# EAGLE design loader (EAGLE 9.4.1)
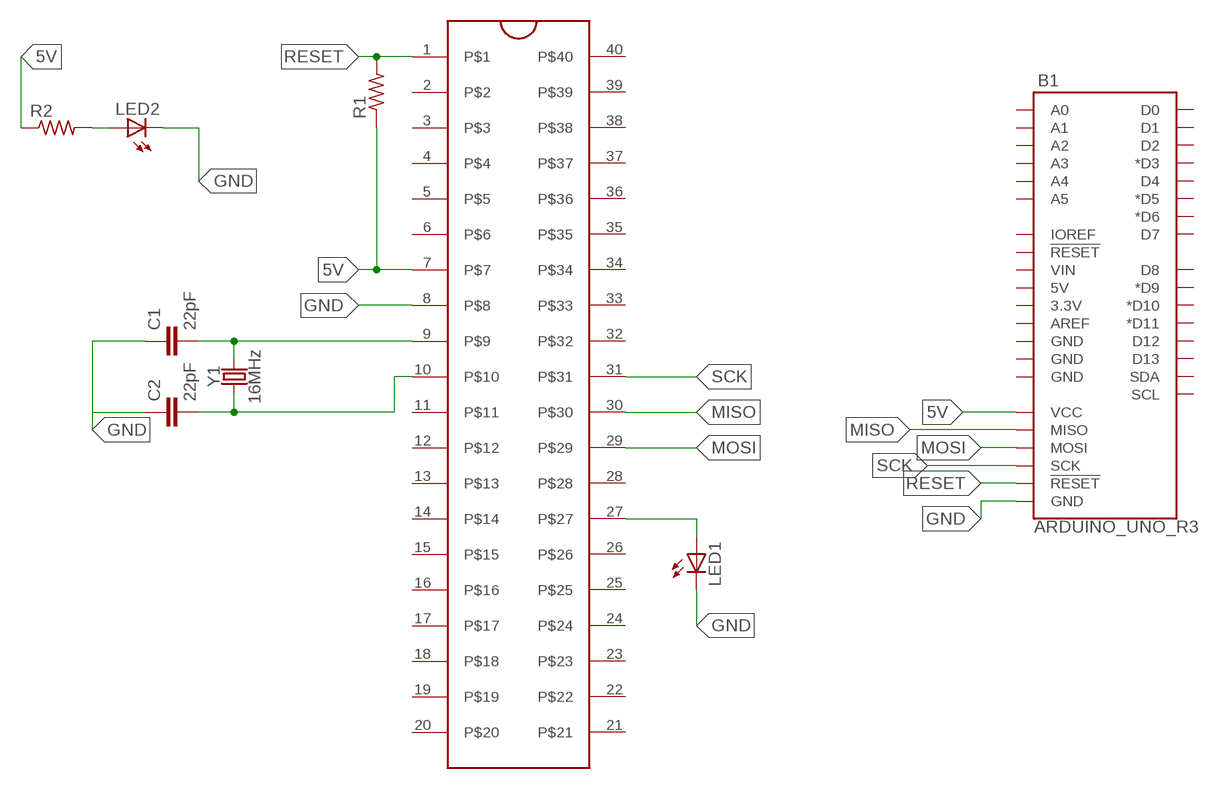
[diagram p0: schematic, sheet 1]

## Parts
B1  ARDUINO_UNO_R3  [ARDUINO_R3]
C1  22pF  22PF-PTH-2.54MM-200V-5%  [CAP-PTH-2.54]
C2  22pF  22PF-PTH-2.54MM-200V-5%  [CAP-PTH-2.54]
LED1  LED5MM  [LED5MM]
LED2  LED5MM  [LED5MM]
R1  R-US_0309/10  [0309/10]
R2  R-US_0309/10  [0309/10]
U$1  ZIFSOCKET-40-6DIL40-6-ZIF_SOCKET  [DIL40-6-ZIF_SOCKET]
Y1  16MHz  CRYSTAL-16MHZPTH-HC49US  [HC49US]

## Nets
5V: B1.VCC R1.1 R2.1 U$1.7
GND: B1.GND@1(GND) C1.1 C2.1 LED1.K(C) LED2.K(C) U$1.8
MISO: B1.MISO U$1.30
MOSI: B1.MOSI U$1.29
N$1: C1.2 U$1.9 Y1.2
N$2: C2.2 U$1.10 Y1.1
N$3: LED1.A U$1.27
N$4: LED2.A R2.2
RESET: B1.RESET@2(!RESET!) R1.2 U$1.1
SCK: B1.SCK U$1.31
Unconnected: B1.3.3V B1.5V B1.A0 B1.A1 B1.A2 B1.A3 B1.A4 B1.A5 B1.AREF B1.D0 B1.D1 B1.D2 B1.D3(*D3) B1.D4 B1.D5(*D5) B1.D6(*D6) B1.D7 B1.D8 B1.D9(*D9) B1.D10(*D10) B1.D11(*D11) B1.D12 B1.D13 B1.GND@2(GND) B1.GND@3(GND) B1.GND@4(GND) B1.IOREF B1.RESET@1(!RESET!) B1.SCL B1.SDA B1.VIN U$1.2 U$1.3 U$1.4 U$1.5 U$1.6 U$1.11 U$1.12 U$1.13 U$1.14 U$1.15 U$1.16 U$1.17 U$1.18 U$1.19 U$1.20 U$1.21 U$1.22 U$1.23 U$1.24 U$1.25 U$1.26 U$1.28 U$1.32 U$1.33 U$1.34 U$1.35 U$1.36 U$1.37 U$1.38 U$1.39 U$1.40

## Library data of the parts
B1 = SparkFun-Boards:ARDUINO_UNO_R3: Arduino R3 Footprint with SPI header Arduino Uno R3 Compatible Footprint. Matches PCB size of the original board. SparkFun Products: SAMD21 Dev Breakout <https://www.sparkfun.com/products/13672> RedBoard <https://www.sparkfun.com/products/12757> R3 Stackable Headers <https://www.sparkfun.com/products/11417>
C1 C2 = SparkFun-Capacitors:22PF: 22pF ceramic capacitors A capacitor is a passive two-terminal electrical component used to store electrical energy temporarily in an electric field.; PROD_ID: CAP-09128
LED1 LED2 = adafruit:LED: LED OSRAM: - CHIPLED LG R971, LG N971, LY N971, LG Q971, LY Q971, LO R971, LY R971 LH N974, LH R974 LS Q976, LO Q976, LY Q976 LO Q996 - Hyper CHIPLED LW Q18S LB Q993, LB Q99A, LB R99A - SideLED LS A670, LO A670, LY A670, LG A670, LP A670 LB A673, LV A673, LT A673, LW A673 LH A674 LY A675 LS A676, LA A676, LO A676, LY A676, LW A676 LS A679, LY A679, LG A679 - Hyper Micro SIDELED® LS Y876, LA Y876, LO Y876, LY Y876 LT Y87S - SmartLED LW L88C, LW L88S LB L89C, LB L89S, LG L890 LS L89K, LO L89K, LY L89K LS L896, LA L896, LO L896, LY L896 - TOPLED LS T670, LO T670, LY T670, LG T670, LP T670 LSG T670, LSP T670, LSY T670, LOP T670, LYG T670 LG T671, LOG T671, LSG T671 LB T673, LV T673, LT T673, LW T673 LH T674 LS T676, LA T676, LO T676, LY T676, LB T676, LH T676, LSB T676, LW T676 LB T67C, LV T67C, LT T67C, LS T67K, LO T67K, LY T67K, LW E67C LS E67B, LA E67B, LO E67B, LY E67B, LB E67C, LV E67C, LT E67C LW T67C LS T679, LY T679, LG T679 LS T770, LO T770, LY T770, LG T770, LP T770 LB T773, LV T773, LT T773, LW T773 LH T774 LS E675, LA E675, LY E675, LS T675 LS T776, LA T776, LO T776, LY T776, LB T776 LHGB T686 LT T68C, LB T68C - Hyper Mini TOPLED® LB M676 - Mini TOPLED Santana® LG M470 LS M47K, LO M47K, LY M47K Source: http://www.osram.convergy.de/
R1 R2 = adafruit:R-US_: RESISTOR, American symbol
U$1 = SparkFun-Retired:ZIFSOCKET-40-6: Lever-action ZIF socket for 40-pin ICs
Y1 = SparkFun-Clocks:CRYSTAL-16MHZ: 16MHz Crystal Digikey Example <http://www.digikey.com/product-search/en?keywords=535-9122-1-ND> Frequency: 16MHz Frequency Stability: ±50ppm Frequency Tolerance: ±20ppm Load Capacitance: 18pF SparkFun Products: Pro Micro -5V/16MHz <https://www.sparkfun.com/products/12640> SparkFun Serial Enabled LCD Kit <https://www.sparkfun.com/products/10097>; PROD_ID: XTAL-08181; SF_ID: COM-00536

## Board
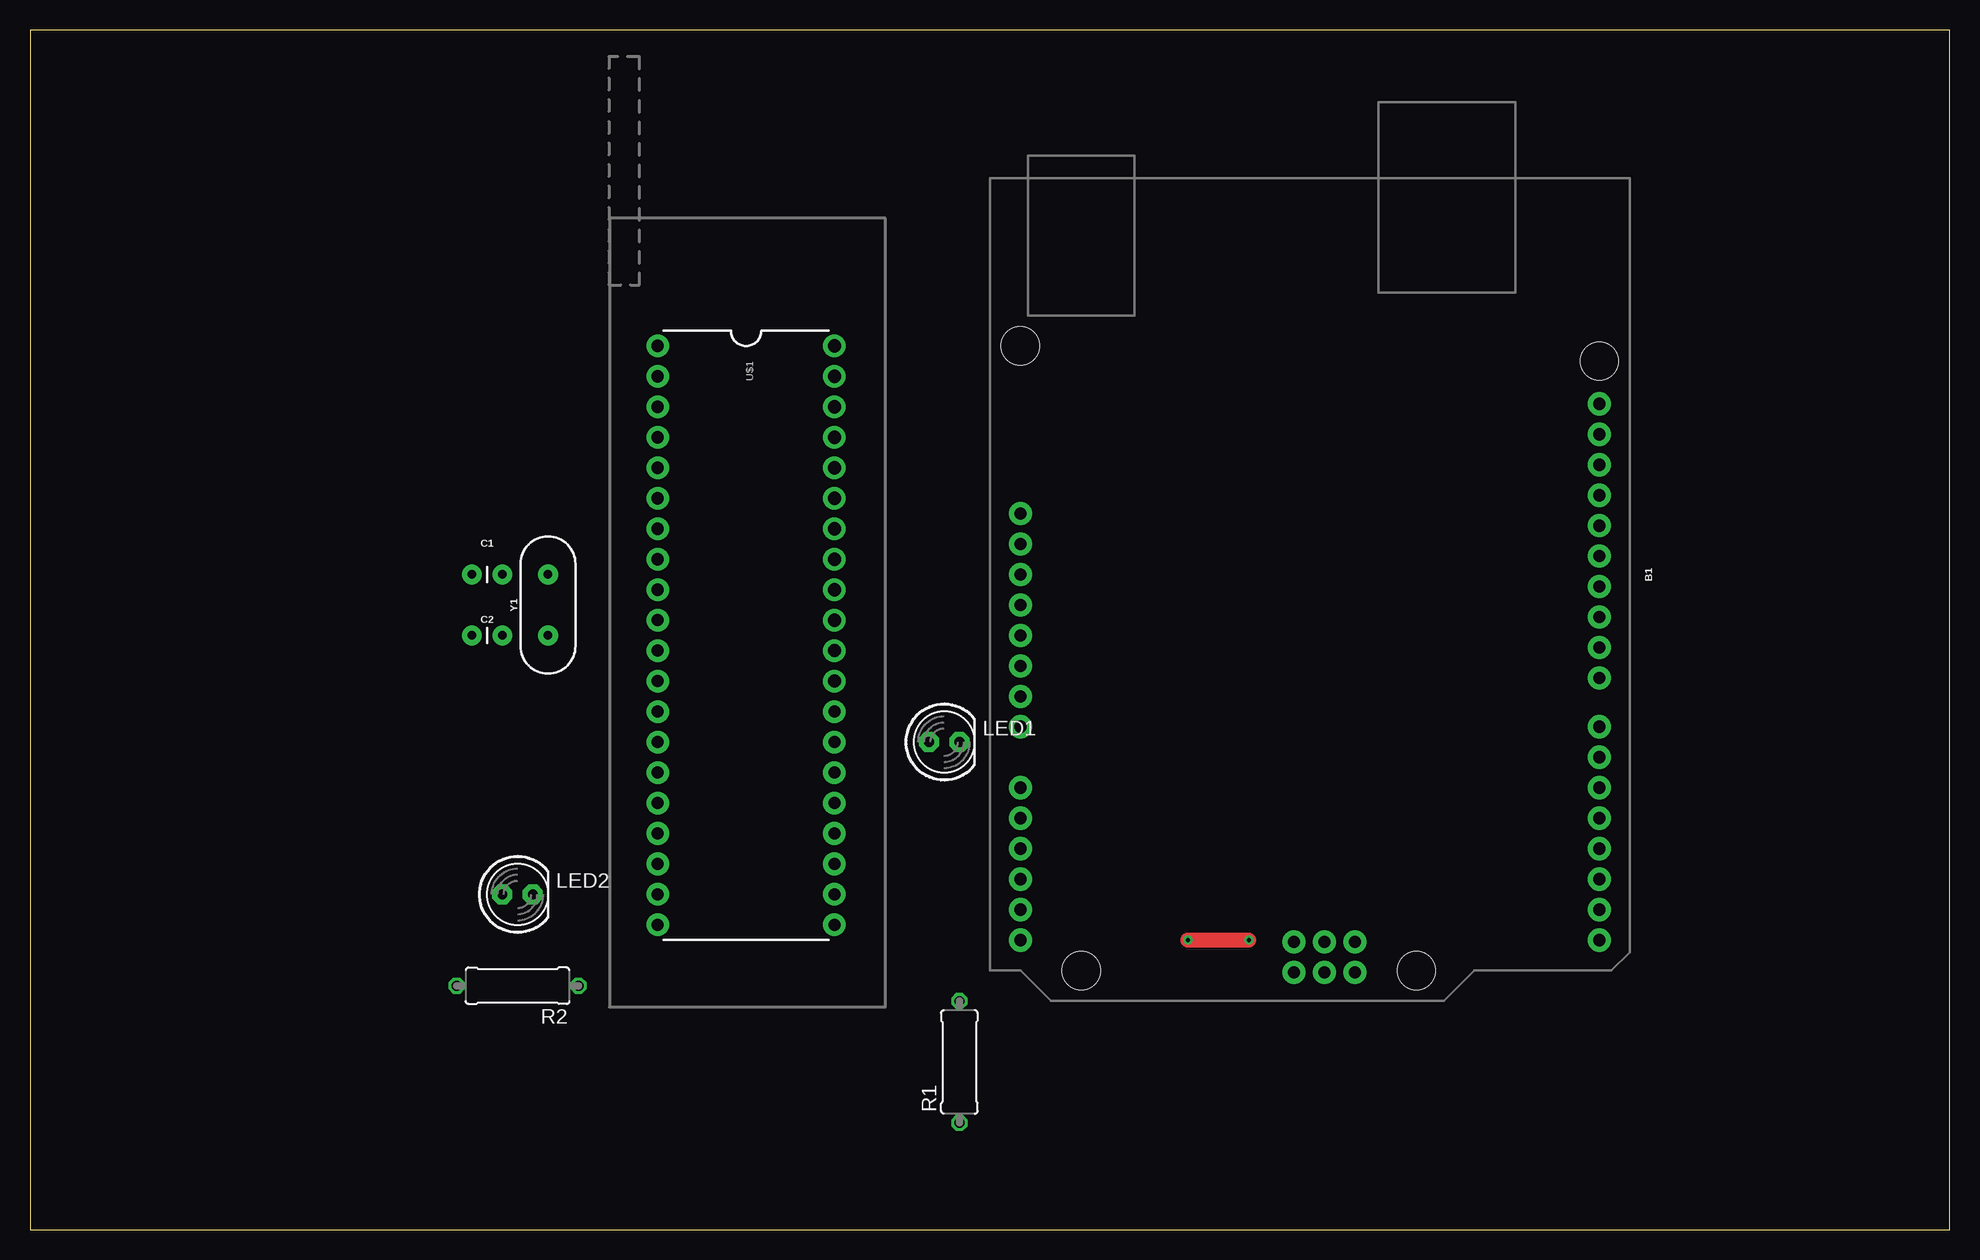
[diagram p1: board, top side]
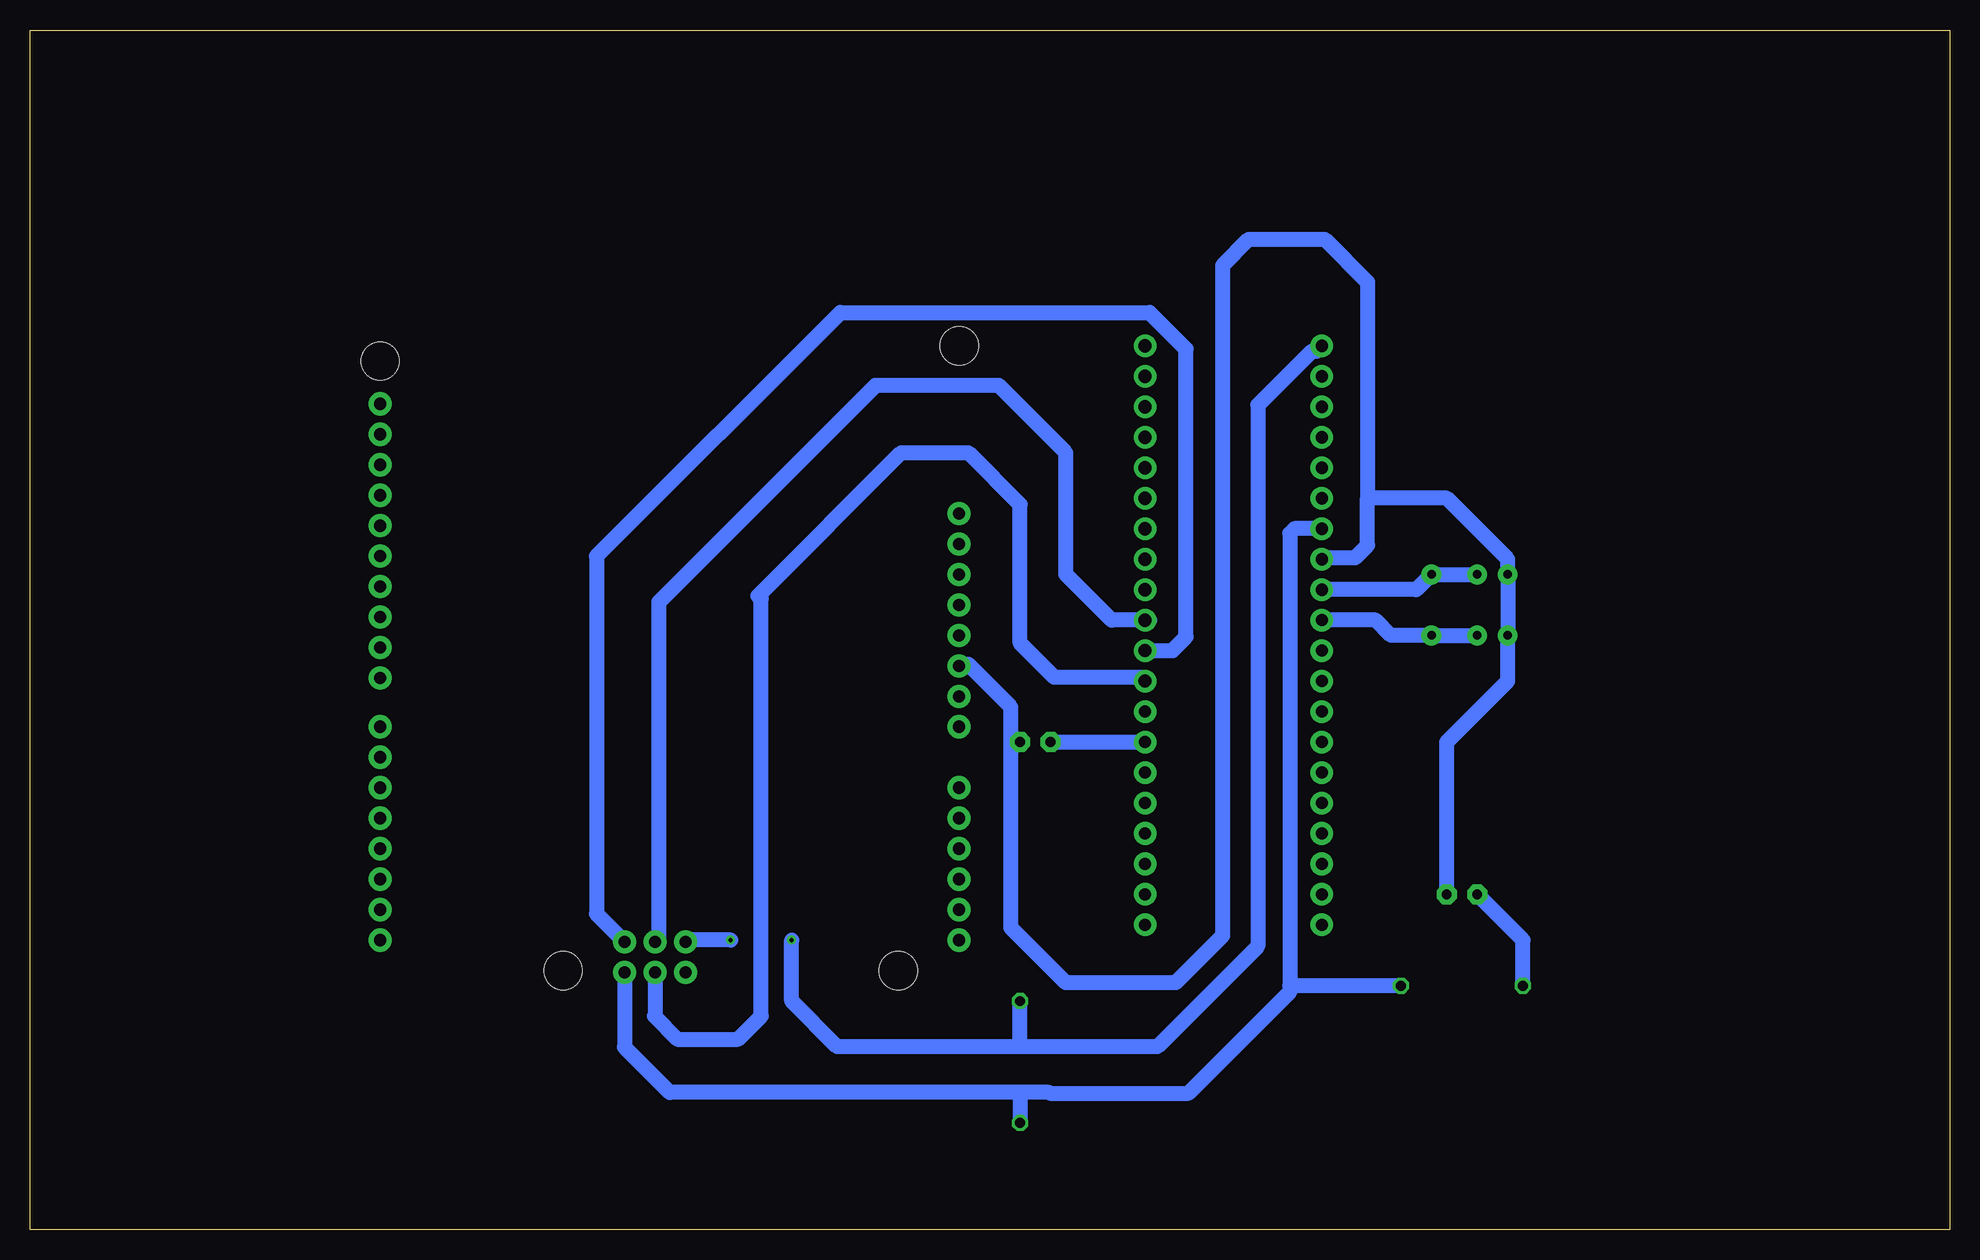
[diagram p2: board, bottom side, seen from below]

Size 160 x 100 mm. Coordinates in mm from the lower left corner, seen from the top.
Outline: 0,0 160,0 160,100 0,100 0,0
Copper layers (1*16): Top 0.035mm / dielectric 1.5mm / Bottom 0.035mm
Design rules "default *": minimum track width 50mil, minimum drill 0.35mm, track to track 20mil, track to pad 20mil, pad to pad 6mil, via to via 6mil, smd to smd 6mil, copper to edge 40mil, drill to drill 6mil, minimum pad ring 10mil, minimum via ring 8mil, stop-mask expansion 4mil, vias tented up to drill 0mil, thermal gap 10mil

### Footprints (pad centres in the part's own frame; a part is rotated, then mirrored left to right if it is on the bottom)
ARDUINO_R3 = drill 1.016 pad 1.93: 3.3V 2.54,-24.13; 5V 5.08,-24.13; A0 17.78,-24.13; A1 20.32,-24.13; A2 22.86,-24.13; A3 25.4,-24.13; A4 27.94,-24.13; A5 30.48,-24.13; AREF -9.144,24.13; D0 30.48,24.13; D1 27.94,24.13; D2 25.4,24.13; D3 22.86,24.13; D4 20.32,24.13; D5 17.78,24.13; D6 15.24,24.13; D7 12.7,24.13; D8 8.636,24.13; D9 6.096,24.13; D10 3.556,24.13; D11 1.016,24.13; D12 -1.524,24.13; D13 -4.064,24.13; GND@1 7.62,-24.13; GND@2 10.16,-24.13; GND@3 -6.604,24.13; GND@4 33.16,-1.32; IOREF -2.54,-24.13; MISO 30.62,3.76; MOSI 33.16,1.22; NC -5.08,-24.13; RESET@1 0,-24.13; RESET@2 30.62,-1.32; SCK 30.62,1.22; SCL -14.224,24.13; SDA -11.684,24.13; VCC 33.16,3.76; VIN 12.7,-24.13 | hole 3.175: -17.78,24.13; 33.02,8.89; 33.02,-19.05; -19.05,-24.13
CAP-PTH-2.54 = drill 0.7 pad 1.651: 1 -1.27,0; 2 1.27,0
LED5MM = drill 0.813 pad 1.676 octagon: A -1.27,0; K 1.27,0
0309/10 = drill 0.813 octagon: 1 -5.08,0; 2 5.08,0
DIL40-6-ZIF_SOCKET = drill 1.016 pad 1.88: 1 -24.13,-7.366; 2 -21.59,-7.366; 3 -19.05,-7.366; 4 -16.51,-7.366; 5 -13.97,-7.366; 6 -11.43,-7.366; 7 -8.89,-7.366; 8 -6.35,-7.366; 9 -3.81,-7.366; 10 -1.27,-7.366; 11 1.27,-7.366; 12 3.81,-7.366; 13 6.35,-7.366; 14 8.89,-7.366; 15 11.43,-7.366; 16 13.97,-7.366; 17 16.51,-7.366; 18 19.05,-7.366; 19 21.59,-7.366; 20 24.13,-7.366; 21 24.13,7.366; 22 21.59,7.366; 23 19.05,7.366; 24 16.51,7.366; 25 13.97,7.366; 26 11.43,7.366; 27 8.89,7.366; 28 6.35,7.366 | drill 1.1 pad 1.88: 29 3.81,7.366; 30 1.27,7.366; 31 -1.27,7.366; 32 -3.81,7.366; 33 -6.35,7.366; 34 -8.89,7.366; 35 -11.43,7.366; 36 -13.97,7.366; 37 -16.51,7.366; 38 -19.05,7.366; 39 -21.59,7.366; 40 -24.13,7.366
HC49US = drill 0.7 pad 1.651: 1 -2.54,0; 2 2.54,0

### Placement (x,y rotation side)
B1  106.68,54.61 270 top
C1  38.1,54.61 0 top
C2  38.1,49.53 0 top
LED1  76.2,40.64 0 top
LED2  40.64,27.94 0 top
R1  77.47,13.97 90 top
R2  40.64,20.32 180 top
U$1  59.69,49.53 270 top
Y1  43.18,52.07 90 top

### Tracks (layer width: path | path; a pad name or v marks a point on that pad's centre or on a via)
5V
  Bottom 1.27: B1.VCC 110.44,15.19 106.68,11.43 77.47,11.43 | U$1.7 54.61,58.42 54.99,58.04 54.99,20.32 | 54.99,20.32 54.99,19.81 63.44,11.37 74.99,11.37 75.06,11.43 77.47,11.43 | 77.47,11.43 R1.1 | R2.1 54.99,20.32
GND
  Bottom 1.27: U$1.8 51.56,56.01 49.53,56.01 48.51,57.02 48.51,60.96 | B1.GND@1 81.79,47.12 78.23,43.56 78.23,40.64 | 48.51,60.96 48.51,78.99 52.07,82.55 58.42,82.55 60.58,80.39 60.58,24.51 64.52,20.57 73.66,20.57 78.23,25.15 78.23,40.64 | 48.51,60.96 41.91,60.96 36.83,55.88 C1.1 C2.1 36.83,45.72 41.91,40.64 LED2.K | LED1.K 78.23,40.64
MISO
  Bottom 1.27: B1.MISO 112.78,26.33 112.78,56.13 92.46,76.45 66.67,76.45 63.63,73.41 63.63,49.4 64.77,48.26 U$1.30
MOSI
  Bottom 1.27: 107.57,21.34 B1.MOSI 107.9,17.83 107.95,17.78 106.05,15.88 100.97,15.88 99.06,17.78 99.06,52.58 99.31,52.83 87.38,64.77 81.79,64.77 77.47,60.45 77.47,48.9 74.61,46.04 67.37,46.04 U$1.29
N$1
  Bottom 1.27: U$1.9 44.45,53.34 Y1.2 C1.2
N$2
  Bottom 1.27: U$1.10 47.83,50.8 46.56,49.53 Y1.1 C2.2
N$3
  Bottom 1.27: LED1.A U$1.27
N$4
  Bottom 1.27: R2.2 35.56,24.13 LED2.A
RESET  (via drill 0.35)
  Top 1.27: v96.52,24.13 v101.6,24.13
  Bottom 1.27: U$1.1 52.78,73.2 53.19,73.2 57.66,68.73 57.66,23.62 66.04,15.24 77.47,15.24 | 77.47,15.24 92.71,15.24 96.52,19.05 v96.52,24.13 | v101.6,24.13 105.22,24.13 B1.RESET@2 | 77.47,15.24 R1.2
SCK
  Bottom 1.27: B1.SCK 107.57,24 107.57,52.32 89.53,70.36 79.25,70.36 73.66,64.77 73.66,54.61 69.85,50.8 U$1.31 66.67,50.8